# Altium schematic sheet NL17SZ74USG_2021-01-09.schdoc
size 52 x 36 mm
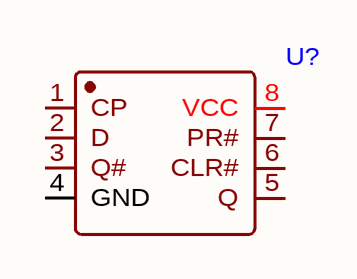
[diagram p0: NL17SZ74USG_2021-01-09.schdoc]

## Parts
U?  (no value)  [US-8_L2.4-W2.1-P0.50-LS3.2-BR]

## Nets

Not connected (* = marked no-connect by the designer): U? 1(CP) 2(D) 3(Q#) 4(GND) 5(Q) 6(CLR#) 7(PR#) 8(VCC)

## Library data of the parts
U? = NL17SZ74USG